# EAGLE design pluginboard_HP (EAGLE 9.2.2)
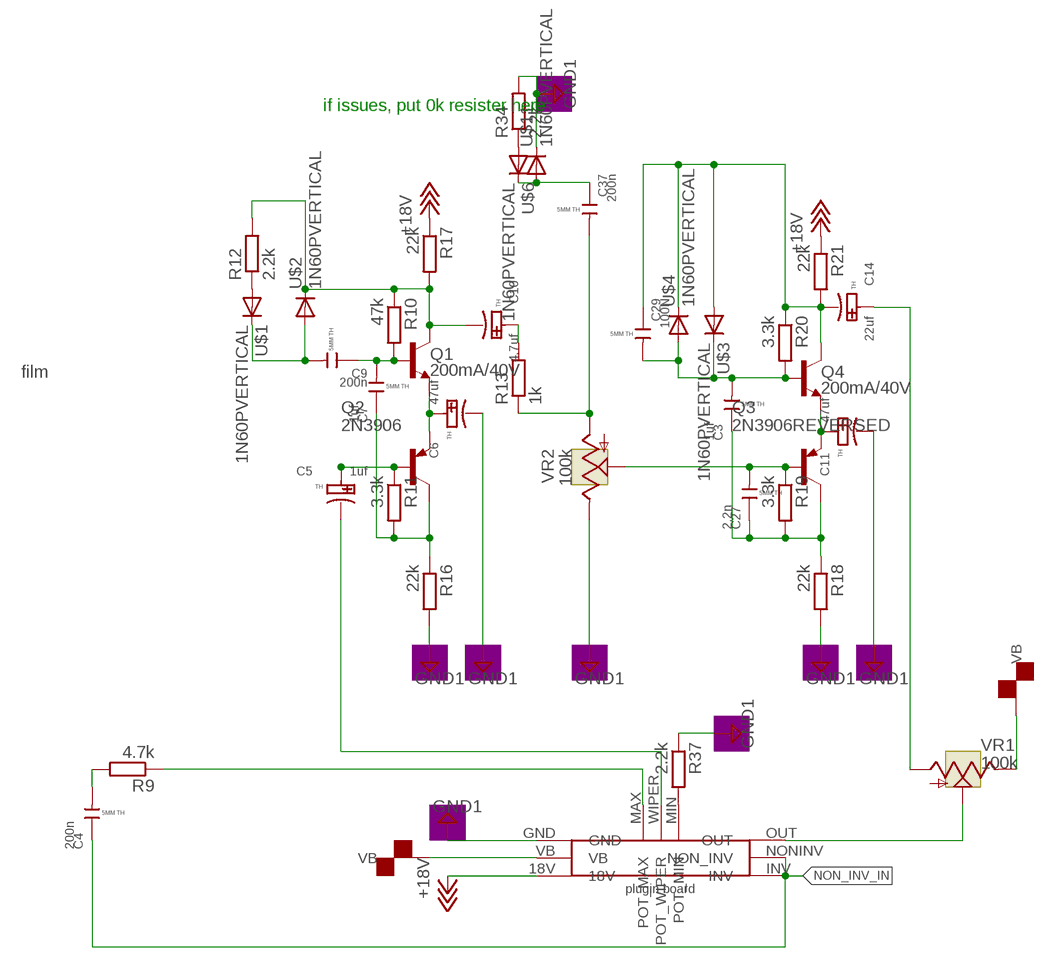
[diagram p0: schematic, sheet 1]

## Parts
C3  1uf  THRU_HOLE_5MM_SPACING  [CERAMIC-5MM]
C4  200n  THRU_HOLE_5MM_SPACING  [CERAMIC-5MM]
C5  1uf  THRU-HOLE-POLARIZED  [PC-D5.3MM]
C6  47uf  THRU-HOLE-POLARIZED  [PC-D5.3MM]
C7  1uf  THRU_HOLE_5MM_SPACING  [CERAMIC-5MM]
C9  200n  THRU_HOLE_5MM_SPACING  [CERAMIC-5MM]
C10  4.7uf  THRU-HOLE-POLARIZED  [PC-D5.3MM]
C11  47uf  THRU-HOLE-POLARIZED  [PC-D5.3MM]
C14  22uf  THRU-HOLE-POLARIZED  [PC-D5.3MM]
C27  2.2n  THRU_HOLE_5MM_SPACING  [CERAMIC-5MM]
C29  100N  THRU_HOLE_5MM_SPACING  [CERAMIC-5MM]
C37  200n  THRU_HOLE_5MM_SPACING  [CERAMIC-5MM]
Q1  200mA/40V  TRANS_NPN-2N3904  [TO-92]
Q2  2N3906  [TO92]
Q3  2N3906REVERSED  [2N3906REVERSED]
Q4  200mA/40V  TRANS_NPN-2N3904  [TO-92]
R9  4.7k  R-EU_R1206  [R1206]
R10  47k  R-EU_R1206  [R1206]
R11  3.3k  R-EU_R1206  [R1206]
R12  2.2k  R-EU_R1206  [R1206]
R13  1k  R-EU_R1206  [R1206]
R16  22k  R-EU_R1206  [R1206]
R17  22k  R-EU_R1206  [R1206]
R18  22k  R-EU_R1206  [R1206]
R19  3.3k  R-EU_R1206  [R1206]
R20  3.3k  R-EU_R1206  [R1206]
R21  22k  R-EU_R1206  [R1206]
R34  2.2k  R-EU_R1206  [R1206]
R37  2.2k  R-EU_R1206  [R1206]
U$1  1N60PVERTICAL  [DO41-1]
U$2  1N60PVERTICAL  [DO41-1]
U$3  1N60PVERTICAL  [DO41-1]
U$4  1N60PVERTICAL  [DO41-1]
U$6  1N60PVERTICAL  [DO41-1]
U$9  GT_BOARD  [PLUGIN_BOARD]
U$11  1N60PVERTICAL  [DO41-1]
VR1  100k  TRIM_US-3223G  [3223G]
VR2  100k  TRIM_US-3223G  [3223G]

## Nets
+18V: R17.1 R21.1 U$9.18V
BB_OUT1: U$9.OUT VR1.2(S)
GND1: C6.- C11.- R16.2 R18.2 R34.2 R37.1 U$9.GND U$11.C VR2.3(E)
N$1: C6.+ Q1.1(E) Q2.3(E)
N$2: C14.+ VR1.1(A)
N$3: R12.1 U$1.A
N$4: C9.2 U$1.C U$2.A
N$5: R37.2 U$9.MIN(POT_MIN)
N$6: C4.2 R9.2
N$12: R9.1 U$9.MAX(POT_MAX)
N$13: C5.- U$9.WIPER(POT_WIPER)
N$14: C5.+ Q2.2(B) R11.1
N$16: C7.2 C9.1 Q1.2(B) R10.2
N$18: C7.1 Q2.1(C) R11.2 R16.1
N$19: C37.2 R13.1 VR2.1(A)
N$23: C10.- Q1.3(C) R10.1 R12.2 R17.2 U$2.C
N$25: C11.+ Q3.3(E) Q4.1(E)
N$26: C10.+ R13.2
N$28: C3.1 C27.1 Q3.1(C) R18.1 R19.2
N$29: C27.2 Q3.2(B) R19.1 VR2.2(S)
N$51: C3.2 C29.2 Q4.2(B) R20.2 U$3.C U$4.A
N$52: R34.1 U$6.A
N$55: C37.1 U$6.C U$11.A
N$63: C14.- C29.1 Q4.3(C) R20.1 R21.2 U$3.A U$4.C
NON_INV_IN: C4.1 U$9.INV U$9.NONINV(NON_INV)
VB: U$9.VB VR1.3(E)

## Notes on the sheet
- if issues, put 0k resister here
- film

## Library data of the parts
C3 C4 C7 C9 C27 C29 C37 = GT_Capacitor:THRU_HOLE_5MM_SPACING: 302010202; PACKAGE: 5MM TH
C5 C6 C10 C11 C14 = GT_Capacitor:THRU-HOLE-POLARIZED: 302030033; PACKAGE: TH
Q1 Q4 = SparkFun-DiscreteSemi:TRANS_NPN: NPN transistor Current controlled devices typically used to amplify current or used as a switch. BC547 - COM-08928 <http://www.sparkfun.com/products/8928> (TO-92 45V 100mA) (1.Collector 2.Base 3.Emitter) 2N3904 - COM-00521 <http://www.sparkfun.com/products/521> (TO-92 40V 200mA) (1.Emitter 2.Base 3.Collector) P2N2222A - COM-12852 <http://www.sparkfun.com/products/12852> (TO-92 40V 600mA) (1.Collector 2.Base 3.Emitter); PROD_ID: TRANS-08447
Q2 = transistor-pnp:2N3906: PNP Transistor
Q3 = GOLD_transistor-pnp:2N3906REVERSED
R9-R13 R16-R21 R34 R37 = resistor:R-EU_: RESISTOR, European symbol
U$1-U$4 U$6 U$11 = diode:1N60P
U$9 = BluePill:GT_BOARD
VR1 VR2 = pot:TRIM_US-: POTENTIOMETER

## Board
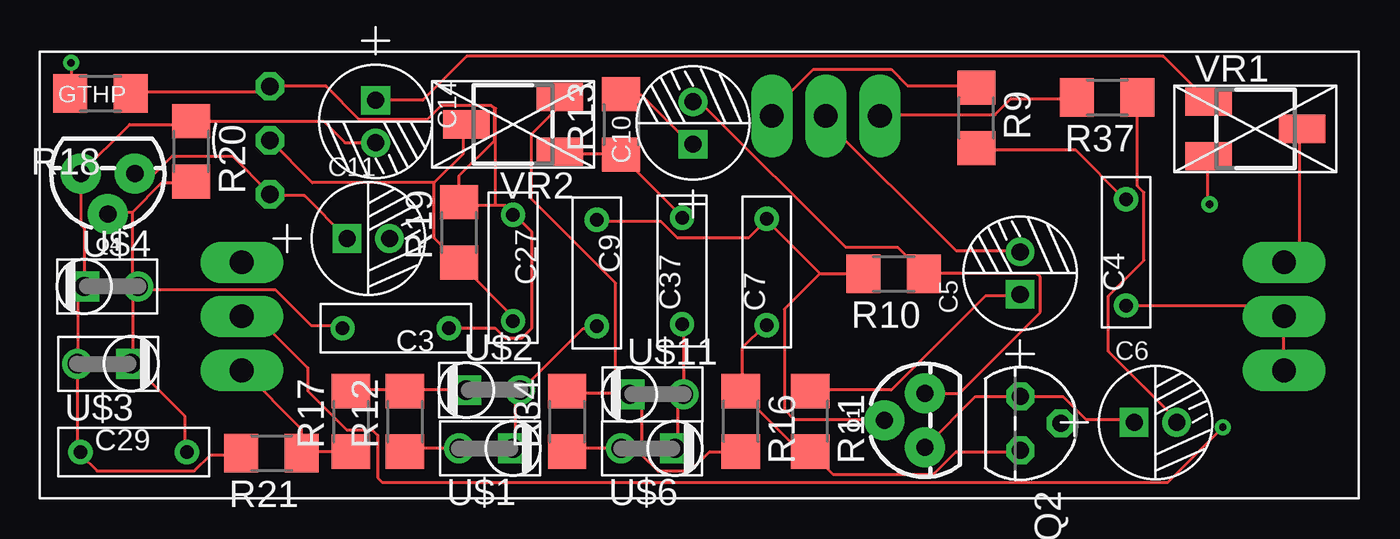
[diagram p1: board, top side]
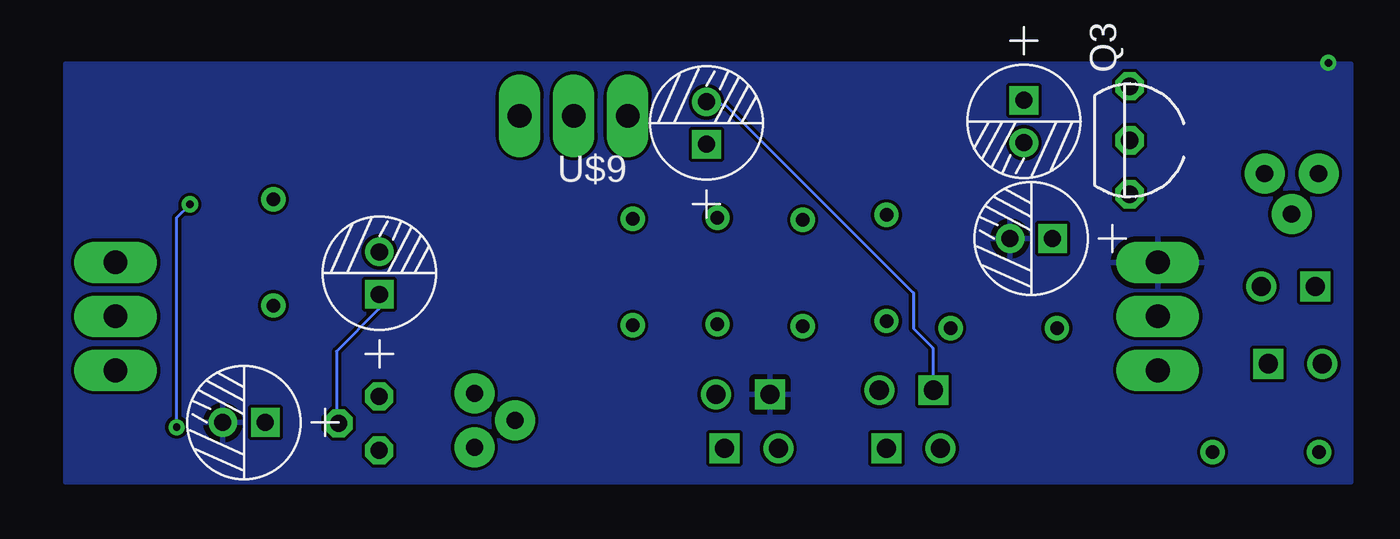
[diagram p2: board, bottom side, seen from below]

No outline drawn. Coordinates in mm, seen from the top.
Copper layers (1*16): Top 0.035mm / dielectric 1.5mm / Bottom 0.035mm
Design rules "default": minimum track width 6mil, minimum drill 0.35mm, track to track 6mil, track to pad 6mil, pad to pad 6mil, via to via 6mil, smd to smd 6mil, copper to edge 40mil, drill to drill 6mil, minimum pad ring 10mil, minimum via ring 8mil, stop-mask expansion 4mil, vias tented up to drill 0mil, thermal gap 10mil

### Footprints (pad centres in the part's own frame; a part is rotated, then mirrored left to right if it is on the bottom)
CERAMIC-5MM = drill 0.635 pad 1.143: 1 -2.5,0; 2 2.5,0
PC-D5.3MM = drill 0.8 pad 1.35 square: + -1,0 | drill 0.8 pad 1.35: - 1,0
TO-92 = drill 0.813 pad 1.88: 1 -1.27,0; 2 0,1.905; 3 1.27,0
TO92 = drill 0.813 octagon: 1 1.27,0; 2 0,1.905; 3 -1.27,0
2N3906REVERSED = drill 0.813 octagon: 1 2.54,0; 2 0,0; 3 -2.54,0
R1206 = smd 1.6 x 1.803: 1 -1.422,0; 2 1.422,0
DO41-1 = drill 0.9: A 1.27,0 | drill 0.9 square: C -1.27,0
PLUGIN_BOARD = drill 1.118 pad 1.956 long: 18V -27.511,0.017; GND -27.511,5.097; INV 21.489,0.017; MAX -2.591,11.989; MIN 2.489,11.989; NONINV 21.489,2.557; OUT 21.489,5.097; VB -27.511,2.557; WIPER -0.051,11.989
3223G = smd 2.184 x 1.321: 1 -2.2,1.273; 2 2.2,0; 3 -2.2,-1.273

### Placement (x,y rotation side)
C3  18.62,85.67 180 top
C4  52.95,89.23 90 top
C5  47.97,88.26 90 top
C6  54.33,81.23 0 top
C7  36.06,88.31 90 top
C9  28.06,88.26 270 top
C10  32.59,95.31 90 top
C11  17.32,89.88 0 top
C14  17.67,95.38 270 top
C27  24.13,88.5 270 top
C29  6.29,79.84 0 top
C37  32.08,88.36 90 top
Q1  43.5,81.33 90 top
Q2  47.98,81.18 270 top
Q3  12.7,94.5 90 bottom
Q4  5.08,92.94 180 top
R9  45.91,95.55 270 top
R10  42.02,88.22 180 top
R11  38.1,81.28 270 top
R12  19.05,81.28 90 top
R13  29.21,95.25 90 top
R16  34.84,81.28 270 top
R17  16.51,81.28 90 top
R18  4.73,96.7 180 top
R19  21.59,90.17 90 top
R20  9,93.98 270 top
R21  12.77,79.79 180 top
R34  26.67,81.28 90 top
R37  52.07,96.52 180 top
U$1  22.86,80.01 180 top
U$2  23.2,82.75 0 top
U$3  4.91,83.99 180 top
U$4  5.24,87.63 0 top
U$6  30.48,80.01 180 top
U$9  38.89,83.67 0 top
U$11  30.88,82.55 0 top
VR1  59.04,95.04 0 top
VR2  24.13,95.25 180 top

### Tracks (layer width: path | path; a pad name or v marks a point on that pad's centre or on a via)
+18V
  Top 0.152: R17.1 16.46,79.86 14.33,79.86 R21.1 14.17,79.86 14.17,80.92 11.43,83.67 U$9.18V
BB_OUT1
  Top 0.152: VR1.2 61.11,94.94 61.11,89.46 60.5,88.85 U$9.OUT
GND1  (via drill 0.35)
  Top 0.152: R16.2 34.75,79.86 33.38,79.86 32.46,78.94 30.94,78.94 30.18,79.7 30.18,81.99 29.72,82.45 U$11.C | 28.96,82.6 29.57,82.6 U$11.C | 28.96,82.6 26.67,82.6 R34.2 | R37.1 53.49,96.47 53.49,92.35 53.8,92.05 53.8,88.85 52.12,87.17 52.12,84.58 55.32,81.38 C6.- | v3.35,98.15 3.35,96.77 R18.2 | 28.96,82.6 28.96,87.78 24.99,91.75 24.99,94.79 26.21,96.01 26.21,96.47 VR2.3 | 28.96,82.6 U$11.C
  Bottom 0.152: v3.35,98.15 3.35,98.1
  pour Bottom: 2.29,98.1 62.74,98.1 62.74,78.42 2.29,78.42
N$1
  Top 0.152: Q1.1 43.59,80.16 45.87,82.45 47.85,82.45 Q2.3 48.01,82.45 49.99,82.45 51.05,81.38 53.19,81.38 C6.+
N$2
  Top 0.152: C14.+ 19.88,96.39 21.95,98.45 54.7,98.45 VR1.1
N$3
  Top 0.152: U$1.A 19.05,80.01 R12.1
N$4
  Top 0.152: C9.2 28.04,85.65 27.43,85.65 24.54,82.75 U$2.A 24.38,82.6 24.23,82.45 24.23,80.01 U$1.C
N$5
  Top 0.152: R37.2 50.6,96.47 47.55,96.47 46.79,95.71 41.45,95.71 U$9.MIN
N$6
  Top 0.152: R9.2 46.02,94.03 50.6,94.03 52.88,91.75 C4.2
N$12
  Top 0.152: R9.1 45.87,97.08 42.67,97.08 41.91,97.84 38.25,97.84 36.42,96.01 36.42,95.71 U$9.MAX
N$13
  Top 0.152: C5.- 47.85,89.31 44.96,89.31 38.71,95.56 U$9.WIPER
N$14
  Top 0.152: R11.1 38.1,82.75 41.91,82.75 46.33,87.17 47.85,87.17 C5.+
  Bottom 0.152: Q2.2 49.99,81.23 49.99,84.58 48.01,86.56 48.01,87.17 C5.+
N$16
  Top 0.152: 38.56,88.24 40.54,88.24 R10.2 | 38.56,88.24 36.12,90.68 C7.2 35.97,90.68 35.2,89.92 31.85,89.92 31.09,90.68 28.19,90.68 C9.1 | 38.56,88.24 36.88,86.56 36.88,81.84 37.34,81.38 41.45,81.38 Q1.2
N$18
  Top 0.152: C7.1 35.97,85.8 34.9,84.73 34.9,82.75 R16.1 34.9,82.6 37.49,80.01 38.1,80.01 R11.2 | R11.2 39.17,78.79 43.89,78.79 44.96,79.86 47.85,79.86 Q2.1 | R11.2
N$19
  Top 0.152: VR2.1 26.36,93.88 29.11,93.88 R13.1 29.26,93.73 32,90.98 C37.2
N$23
  Top 0.152: 19.05,82.75 16.61,82.75 R17.2 | 19.05,82.75 21.79,82.75 U$2.C | 19.05,82.75 R12.2 | Q1.3 43.59,82.6 45.11,82.6 48.92,86.41 48.92,88.09 48.77,88.24 43.59,88.24 R10.1 43.43,88.24 42.22,89.46 39.78,89.46 33.07,96.16 32.61,96.16 C10.-
  Bottom 0.152: U$2.C 21.95,82.75 21.95,84.73 22.86,85.65 22.86,87.33 31.7,96.16 31.85,96.16 32,96.32 32.46,96.32 C10.-
N$25
  Top 0.152: C11.+ 16.31,89.92 14.33,91.9 12.8,91.9 Q3.3 12.65,92.05 10.97,93.73 8.08,93.73 7.32,92.96 6.4,92.96 Q4.1
N$26
  Top 0.152: R13.2 29.26,96.62 30.18,96.62 32.46,94.34 C10.+
N$28
  Top 0.152: R18.1 6.25,96.77 12.5,96.77 12.65,96.93 Q3.1 15.34,97.04 16.9,95.48 20.09,95.48 20.74,96.14 23.12,96.14 23.25,96 23.25,94.5 21.59,92.83 R19.2 21.64,91.44 23.32,91.44 | 23.32,91.44 23.77,91.44 24.08,91.14 C27.1 24.23,90.98 24.99,90.22 24.99,85.65 24.54,85.19 23.77,85.19 23.32,85.65 21.18,85.65 C3.1 | 23.32,91.44 23.32,96.01
N$29
  Top 0.152: C27.2 24.23,86.11 21.64,88.7 R19.1 21.49,88.85 20.42,89.92 20.42,92.51 | 20.42,92.51 21.79,93.88 21.79,95.25 VR2.2 | 20.42,92.51 14.69,92.51 Q3.2
N$51
  Top 0.152: C29.2 8.69,79.86 8.69,81.53 6.25,83.97 U$3.C 6.25,84.12 6.25,87.33 6.4,87.48 U$4.A | 6.25,91.14 7.62,92.51 8.99,92.51 R20.2 | 6.25,91.14 5.18,91.14 Q4.2 | C3.2 16,85.8 14.63,85.8 12.95,87.48 6.55,87.48 U$4.A | 6.25,91.14 6.25,87.78 6.4,87.63 U$4.A
N$52
  Top 0.152: U$6.A 26.67,80.01 R34.1
N$55
  Top 0.152: C37.1 32.16,85.8 32.16,82.6 U$11.A 32,82.45 31.85,82.3 31.85,80.01 U$6.C
N$63
  Top 0.152: R21.2 11.28,79.7 9.91,79.7 9.14,78.94 4.57,78.94 3.81,79.7 C29.1 3.66,79.86 3.66,83.97 U$3.A 3.66,84.12 3.66,87.17 3.96,87.48 U$4.C 3.96,90.37 3.81,90.53 Q4.3 3.81,92.96 6.1,95.25 8.99,95.25 R20.1 15.21,95.4 16.23,94.39 C14.-
NON_INV_IN
  Top 0.152: C4.1 53.03,86.72 59.89,86.72 60.35,86.26 U$9.NONINV 60.35,86.11 60.35,83.82 U$9.INV
VB  (via drill 0.35)
  Top 0.152: 56.69,94.34 56.69,93.88 56.8,93.79 | 11.73,86.11 11.43,86.11 U$9.VB 12.05,86.22 14.48,83.8 14.48,82.71 16.3,80.89 17.51,80.89 17.76,80.63 17.76,78.63 17.98,78.41 54.91,78.41 v57.5,81.01 | 56.8,93.79 VR1.3 | v56.88,91.49 56.8,91.56 56.8,93.79
  Bottom 0.152: v57.5,81.01 57.5,90.87 v56.88,91.49

### Text on the board
tPlace: GTHP